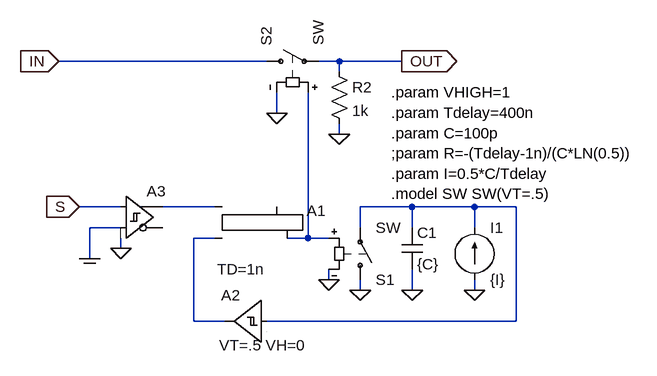
[diagram p0: schematic leb_old.asc]
leb_old.asc, the LTspice schematic file:
Version 4
SHEET 1 1024 680
WIRE 64 -160 -256 -160
WIRE 176 -160 144 -160
WIRE 272 -160 176 -160
WIRE 176 -144 176 -160
WIRE 80 -80 80 -112
WIRE 176 -48 176 -64
WIRE -160 64 -224 64
WIRE -16 64 -96 64
WIRE 288 64 208 64
WIRE 384 64 288 64
WIRE 448 64 384 64
WIRE -160 96 -208 96
WIRE 208 96 208 64
WIRE 288 96 288 64
WIRE 384 96 384 64
WIRE -16 112 -48 112
WIRE 128 112 128 -112
WIRE 128 112 96 112
WIRE 160 112 128 112
WIRE -160 128 -160 112
WIRE -208 144 -208 96
WIRE 160 176 160 160
WIRE 208 192 208 176
WIRE 288 192 288 160
WIRE 384 192 384 176
WIRE -48 240 -48 112
WIRE 0 240 -48 240
WIRE 448 240 448 64
WIRE 448 240 64 240
FLAG -224 64 S
IOPIN -224 64 In
FLAG 160 176 0
FLAG 208 192 0
FLAG 288 192 0
FLAG -208 144 COM
FLAG -160 128 0
FLAG -256 -160 IN
IOPIN -256 -160 In
FLAG 272 -160 OUT
IOPIN 272 -160 Out
FLAG 80 -80 0
FLAG 176 -48 0
FLAG 384 192 0
SYMBOL Digital\\srflop 32 16 R0
WINDOW 3 -44 144 Left 2
SYMATTR Value TD=1n
SYMATTR InstName A1
SYMBOL sw 208 192 M180
SYMATTR InstName S1
SYMBOL cap 272 96 R0
SYMATTR InstName C1
SYMATTR Value {C}
SYMBOL Digital\\schmtbuf 64 176 M0
WINDOW 3 -60 101 Left 2
SYMATTR Value VT=.5 VH=0
SYMATTR InstName A2
SYMBOL Digital\\diffschmitt -160 16 R0
WINDOW 3 8 44 Invisible 2
SYMATTR Value VHIGH={VHIGH}
SYMATTR InstName A3
SYMBOL sw 48 -160 R270
SYMATTR InstName S2
SYMBOL res 160 -160 R0
SYMATTR InstName R2
SYMATTR Value 1k
SYMBOL current 384 176 M180
WINDOW 0 24 80 Left 2
WINDOW 3 24 0 Left 2
WINDOW 123 0 0 Left 0
WINDOW 39 0 0 Left 0
SYMATTR InstName I1
SYMATTR Value {I}
TEXT 256 -112 Left 2 !.param VHIGH=1\n.param Tdelay=400n\n.param C=100p\n;param R=-(Tdelay-1n)/(C*LN(0.5))\n.param I=0.5*C/Tdelay\n.model SW SW(VT=.5)

The netlist it stands for:
* leb_old.asc
A1 N001 N003 0 0 0 N004 0 0 SRFLOP TD=1n
S1 0 N002 N004 0 SW
C1 N002 0 {C}
A2 N002 0 0 0 0 0 N003 0 SCHMITT VT=.5 VH=0
A3 S COM 0 0 0 0 N001 0 SCHMITT VHIGH={VHIGH}
S2 IN OUT N004 0 SW
R2 OUT 0 1k
I1 0 N002 {I}
.param VHIGH=1
.param Tdelay=400n
.param C=100p
;param R=-(Tdelay-1n)/(C*LN(0.5))
.param I=0.5*C/Tdelay
.model SW SW(VT=.5)
.backanno
.end